# Altium schematic sheet export.SchDoc
size A4
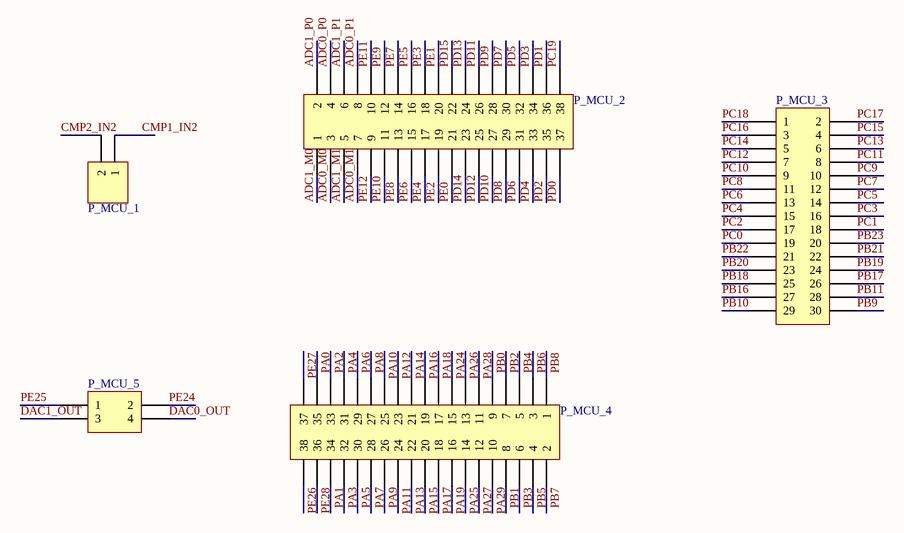
[diagram p0: export.SchDoc]

## Parts
P_MCU_1  Header 2  [HDR1X2]  (value not drawn)
P_MCU_2  Header 19X2  [HDR2X19]  (value not drawn)
P_MCU_3  Header 15X2  [HDR2X15]  (value not drawn)
P_MCU_4  Header 19X2  [HDR2X19]  (value not drawn)
P_MCU_5  Header 2X2  [HDR2X2]  (value not drawn)

## Nets
ADC0_M0: P_MCU_2.3
ADC0_M1: P_MCU_2.7
ADC0_P0: P_MCU_2.4
ADC0_P1: P_MCU_2.8
ADC1_M0: P_MCU_2.1
ADC1_M1: P_MCU_2.5
ADC1_P0: P_MCU_2.2
ADC1_P1: P_MCU_2.6
CMP1_IN2: P_MCU_1.1
CMP2_IN2: P_MCU_1.2
DAC0_OUT: P_MCU_5.4
DAC1_OUT: P_MCU_5.3
PA0: P_MCU_4.35
PA1: P_MCU_4.34
PA2: P_MCU_4.33
PA3: P_MCU_4.32
PA4: P_MCU_4.31
PA5: P_MCU_4.30
PA6: P_MCU_4.29
PA7: P_MCU_4.28
PA8: P_MCU_4.27
PA9: P_MCU_4.26
PA10: P_MCU_4.25
PA11: P_MCU_4.24
PA12: P_MCU_4.23
PA13: P_MCU_4.22
PA14: P_MCU_4.21
PA15: P_MCU_4.20
PA16: P_MCU_4.19
PA17: P_MCU_4.18
PA18: P_MCU_4.17
PA19: P_MCU_4.16
PA24: P_MCU_4.15
PA25: P_MCU_4.14
PA26: P_MCU_4.13
PA27: P_MCU_4.12
PA28: P_MCU_4.11
PA29: P_MCU_4.10
PB0: P_MCU_4.9
PB1: P_MCU_4.8
PB2: P_MCU_4.7
PB3: P_MCU_4.6
PB4: P_MCU_4.5
PB5: P_MCU_4.4
PB6: P_MCU_4.3
PB7: P_MCU_4.2
PB8: P_MCU_4.1
PB9: P_MCU_3.30
PB10: P_MCU_3.29
PB11: P_MCU_3.28
PB16: P_MCU_3.27
PB17: P_MCU_3.26
PB18: P_MCU_3.25
PB19: P_MCU_3.24
PB20: P_MCU_3.23
PB21: P_MCU_3.22
PB22: P_MCU_3.21
PB23: P_MCU_3.20
PC0: P_MCU_3.19
PC1: P_MCU_3.18
PC2: P_MCU_3.17
PC3: P_MCU_3.16
PC4: P_MCU_3.15
PC5: P_MCU_3.14
PC6: P_MCU_3.13
PC7: P_MCU_3.12
PC8: P_MCU_3.11
PC9: P_MCU_3.10
PC10: P_MCU_3.9
PC11: P_MCU_3.8
PC12: P_MCU_3.7
PC13: P_MCU_3.6
PC14: P_MCU_3.5
PC15: P_MCU_3.4
PC16: P_MCU_3.3
PC17: P_MCU_3.2
PC18: P_MCU_3.1
PC19: P_MCU_2.38
PD0: P_MCU_2.37
PD1: P_MCU_2.36
PD2: P_MCU_2.35
PD3: P_MCU_2.34
PD4: P_MCU_2.33
PD5: P_MCU_2.32
PD6: P_MCU_2.31
PD7: P_MCU_2.30
PD8: P_MCU_2.29
PD9: P_MCU_2.28
PD10: P_MCU_2.27
PD11: P_MCU_2.26
PD12: P_MCU_2.25
PD13: P_MCU_2.24
PD14: P_MCU_2.23
PD15: P_MCU_2.22
PE0: P_MCU_2.21
PE1: P_MCU_2.20
PE2: P_MCU_2.19
PE3: P_MCU_2.18
PE4: P_MCU_2.17
PE5: P_MCU_2.16
PE6: P_MCU_2.15
PE7: P_MCU_2.14
PE8: P_MCU_2.13
PE9: P_MCU_2.12
PE10: P_MCU_2.11
PE11: P_MCU_2.10
PE12: P_MCU_2.9
PE24: P_MCU_5.2
PE25: P_MCU_5.1
PE26: P_MCU_4.38
PE27: P_MCU_4.37
PE28: P_MCU_4.36

## Library data of the parts
P_MCU_1 = Header 2: Header, 2-Pin; LatestRevisionDate: 17-Jul-2002; LatestRevisionNote: Re-released for DXP Platform.; Publisher: Altium Limited
P_MCU_2 P_MCU_4 = Header 19X2: Header, 19-Pin, Dual row; LatestRevisionDate: 17-Jul-2002; LatestRevisionNote: Re-released for DXP Platform.; Publisher: Altium Limited
P_MCU_3 = Header 15X2: Header, 15-Pin, Dual row; LatestRevisionDate: 17-Jul-2002; LatestRevisionNote: Re-released for DXP Platform.; Publisher: Altium Limited
P_MCU_5 = Header 2X2: Header, 2-Pin, Dual row; LatestRevisionDate: 17-Jul-2002; LatestRevisionNote: Re-released for DXP Platform.; Publisher: Altium Limited